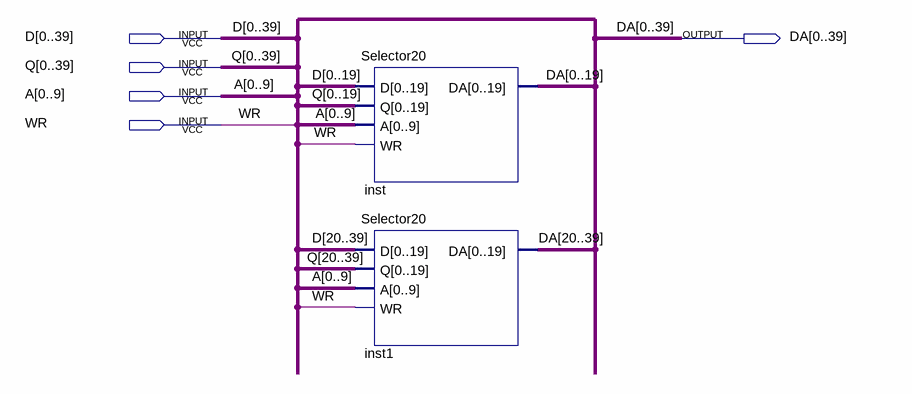
[diagram p0: schematic sheet]
// Quartus schematic Selector40.bdf as structural Verilog: 2 symbols, 5 pins
module Selector40 (
  input  [0:39] D,
  input  [0:39] Q,
  input  [0:9] A,
  input  WR,
  output [0:39] DA
);

  Selector20 inst (.D(D[0:19]), .Q(Q[0:19]), .A(A), .WR(WR), .DA(DA[0:19]));
  Selector20 inst1 (.D(D[20:39]), .Q(Q[20:39]), .A(A), .WR(WR), .DA(DA[20:39]));
endmodule
